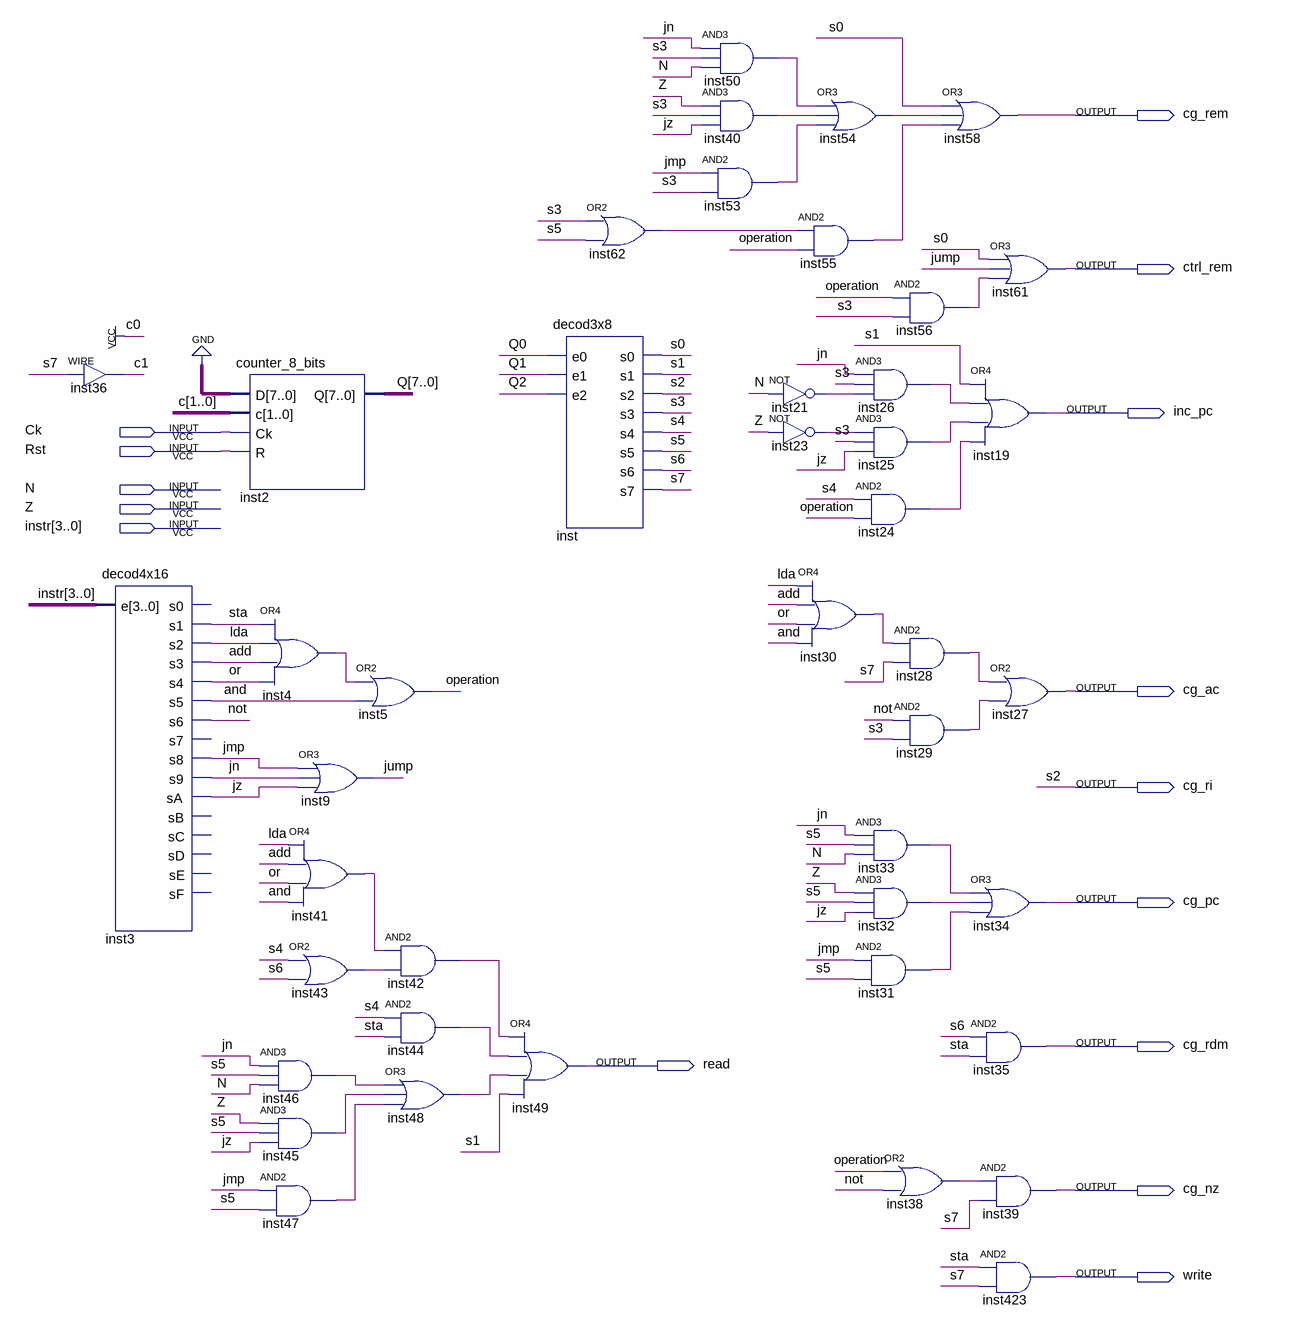
[diagram p0: schematic sheet]
// Quartus schematic control_unit.bdf as structural Verilog: 43 symbols, 15 pins
module control_unit (
  input  Ck,
  input  Rst,
  input  N,
  input  Z,
  input  [3:0] instr,
  output cg_rem,
  output ctrl_rem,
  output inc_pc,
  output cg_ac,
  output cg_ri,
  output cg_pc,
  output cg_rdm,
  output read,
  output cg_nz,
  output write
);

  wire add, \and , inst4_out, inst21_out, inst23_out, inst24_out, inst25_out, inst26_out, inst28_out,
       inst29_out, inst30_out, inst31_out, inst32_out, inst33_out, inst38_out, inst40_out, inst41_out,
       inst42_out, inst43_out, inst44_out, inst45_out, inst46_out, inst47_out, inst48_out, inst50_out,
       inst53_out, inst54_out, inst55_out, inst56_out, inst62_out, jmp, jn, jump, jz, lda, \not , operation,
       \or , s0, s1, s3, s4, s5, s6, s7, sta;
  wire [1:1] c;
  wire [7:0] Q;

  assign c[1] = s7;  // WIRE inst36
  decod4x16 inst3 (
    .e(instr), .s1(sta), .s2(lda), .s3(add), .s4(\or ), .s5(\and ), .s6(\not ), .s8(jmp), .s9(jn), .sA(jz));  // open: s0, s7, sB, sC, sD, sE, sF
  counter_8_bits inst2 (.D({8{1'b0}}), .c({c[1], 1'b1}), .Ck(Ck), .R(Rst), .Q(Q));
  or inst4 (inst4_out, sta, lda, add, \or );
  and inst46 (inst46_out, jn, s5, N);
  and inst45 (inst45_out, Z, s5, jz);
  and inst47 (inst47_out, jmp, s5);
  or inst9 (jump, jmp, jn, jz);
  or inst41 (inst41_out, lda, add, \or , \and );
  or inst43 (inst43_out, s4, s6);
  or inst5 (operation, inst4_out, \and );
  and inst42 (inst42_out, inst41_out, inst43_out);
  and inst44 (inst44_out, s4, sta);
  or inst48 (inst48_out, inst46_out, inst45_out, inst47_out);
  decod3x8 inst (
    .e0(Q[0]), .e1(Q[1]), .e2(Q[2]), .s0(s0), .s1(s1), .s2(cg_ri), .s3(s3), .s4(s4), .s5(s5), .s6(s6), .s7(s7));
  or inst49 (read, inst42_out, inst44_out, inst48_out, s1);
  or inst62 (inst62_out, s3, s5);
  and inst50 (inst50_out, jn, s3, N);
  and inst40 (inst40_out, Z, s3, jz);
  and inst53 (inst53_out, jmp, s3);
  and inst55 (inst55_out, inst62_out, operation);
  not inst21 (inst21_out, N);
  not inst23 (inst23_out, Z);
  or inst30 (inst30_out, lda, add, \or , \and );
  or inst54 (inst54_out, inst50_out, inst40_out, inst53_out);
  and inst26 (inst26_out, jn, s3, inst21_out);
  and inst25 (inst25_out, inst23_out, s3, jz);
  and inst24 (inst24_out, s4, operation);
  and inst33 (inst33_out, jn, s5, N);
  and inst32 (inst32_out, Z, s5, jz);
  and inst31 (inst31_out, jmp, s5);
  or inst38 (inst38_out, operation, \not );
  or inst58 (cg_rem, s0, inst54_out, inst55_out);
  and inst56 (inst56_out, operation, s3);
  and inst28 (inst28_out, inst30_out, s7);
  and inst29 (inst29_out, \not , s3);
  or inst61 (ctrl_rem, s0, jump, inst56_out);
  or inst19 (inc_pc, s1, inst26_out, inst25_out, inst24_out);
  or inst27 (cg_ac, inst28_out, inst29_out);
  or inst34 (cg_pc, inst33_out, inst32_out, inst31_out);
  and inst35 (cg_rdm, s6, sta);
  and inst39 (cg_nz, inst38_out, s7);
  and inst423 (write, sta, s7);

  // Other names for the same wires on the sheet: s2 = cg_ri
endmodule
